# EAGLE design Mag_Read_STM_OUT (EAGLE 6.6.0)

## Sheet 1 of 3
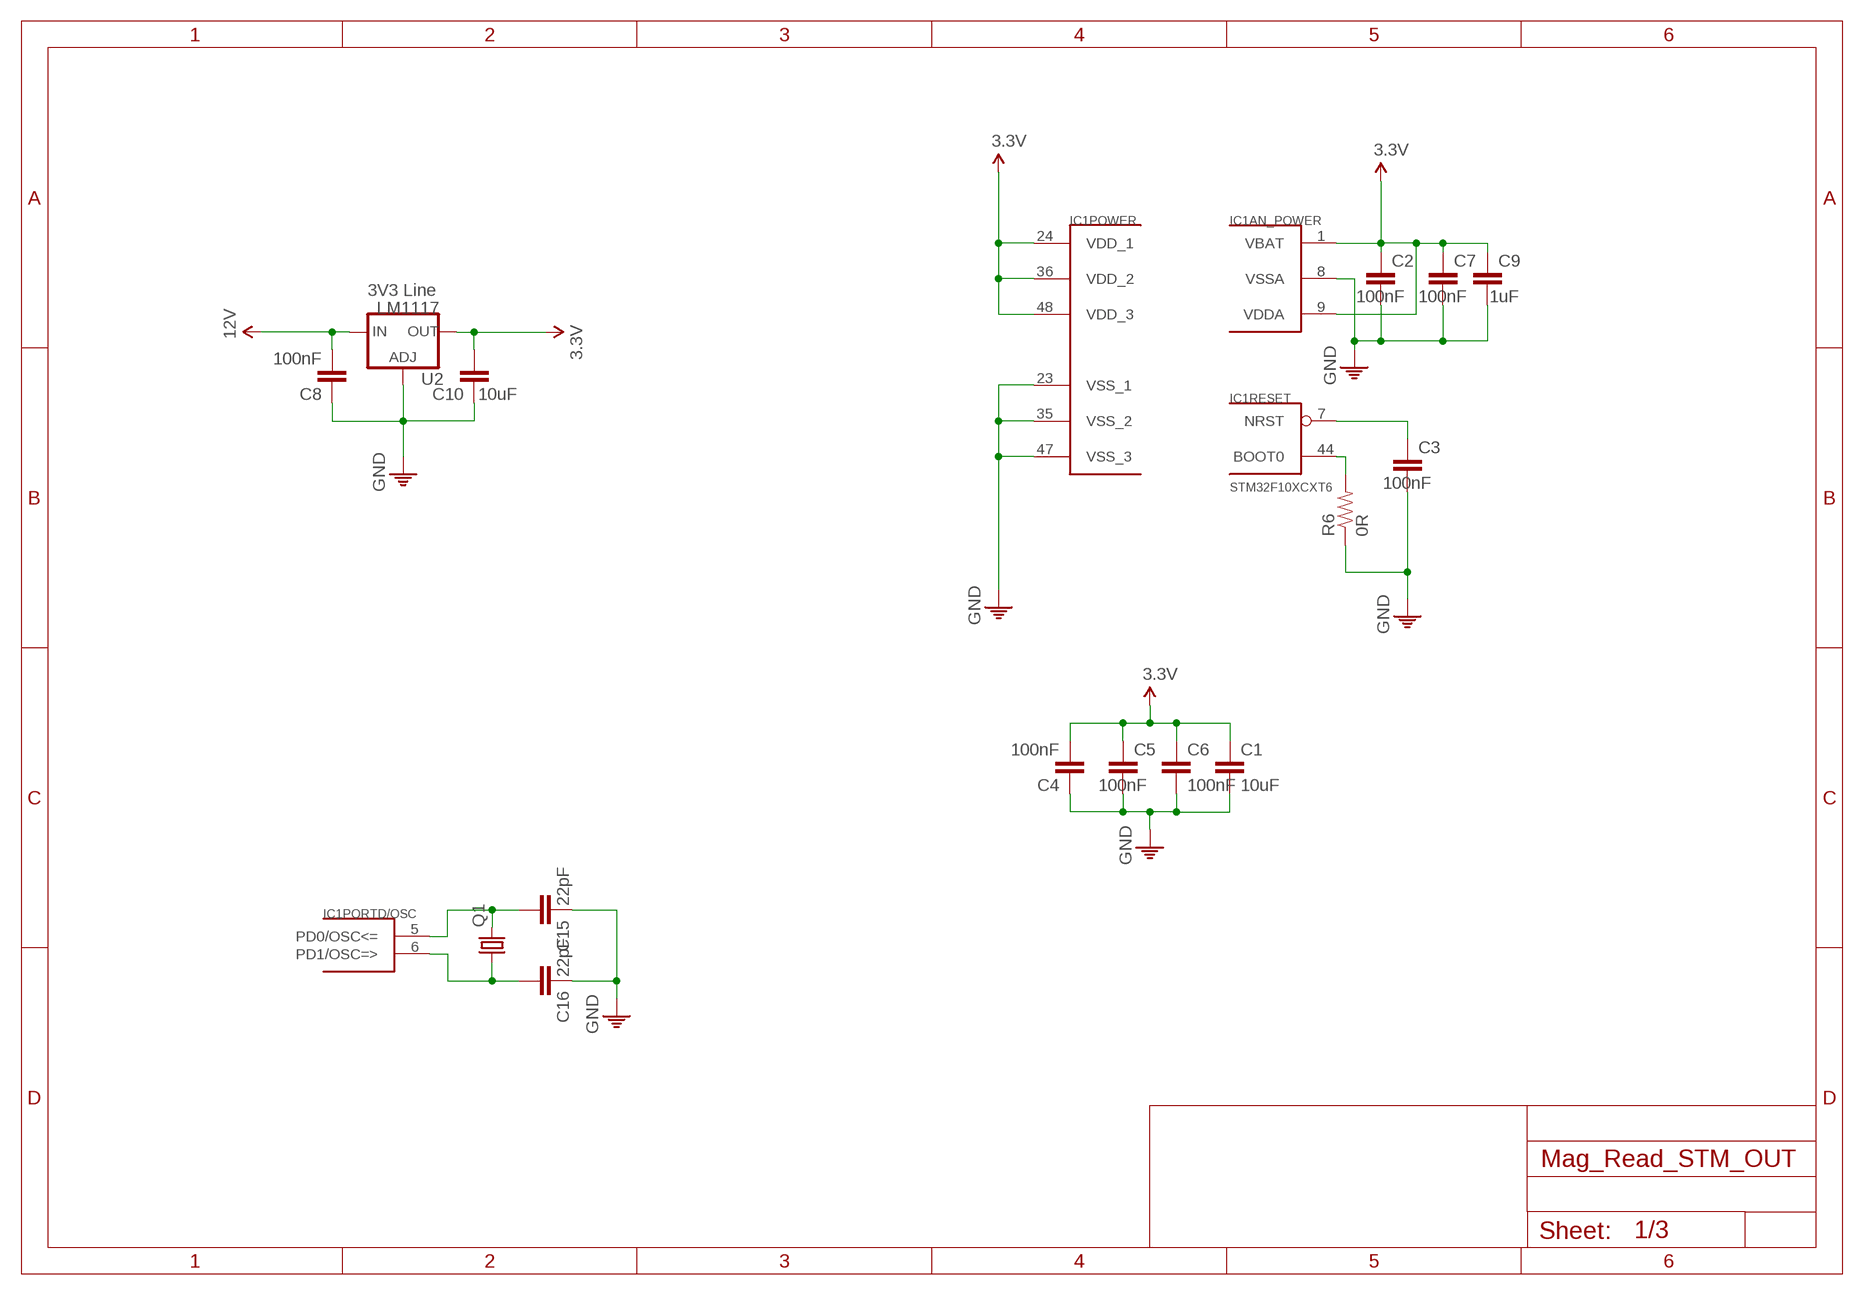
[diagram p0: schematic, sheet 1]

### Parts
C1  10uF  C-EUC0603  [C0603]
C2  100nF  C-EUC0603  [C0603]
C3  100nF  C-EUC0603  [C0603]
C4  100nF  C-EUC0603  [C0603]
C5  100nF  C-EUC0603  [C0603]
C6  100nF  C-EUC0603  [C0603]
C7  100nF  C-EUC0603  [C0603]
C8  100nF  C-EUC0603  [C0603]
C9  1uF  C-EUC0603  [C0603]
C10  10uF  C-EUC0603  [C0603]
C15  22pF  C-EUC0603  [C0603]
C16  22pF  C-EUC0603  [C0603]
IC1  STM32F10XCXT6  [TQFP48]
Q1  CRYSTALCTS406  [CTS406]
R6  0R  RESISTOR0603-RES  [0603-RES]
U2  LM1117  V_REG_317SMD  [SOT223]

### Nets
3.3V: C1.1 C2.1 C4.2 C5.1 C6.1 C7.1 C9.1 C10.2 IC1.1(AN_POWER:VBAT) IC1.9(AN_POWER:VDDA) IC1.24(POWER:VDD_1) IC1.36(POWER:VDD_2) IC1.48(POWER:VDD_3) U2.2(OUT) U2.4(OUT) ; also sheet 2,3
12V: C8.2 U2.3(IN) ; also sheet 3
GND: C1.2 C2.2 C3.2 C4.1 C5.2 C6.2 C7.2 C8.1 C9.2 C10.1 C15.1 C16.1 IC1.8(AN_POWER:VSSA) IC1.23(POWER:VSS_1) IC1.35(POWER:VSS_2) IC1.47(POWER:VSS_3) R6.1 U2.1(ADJ) ; also sheet 2,3
N$1: C15.2 IC1.5(PORTD/OSC:PD0/OSC<=) Q1.3
N$4: C16.2 IC1.6(PORTD/OSC:PD1/OSC=>) Q1.1
N$13: IC1.44(RESET:BOOT0) R6.2
NRST: C3.1 IC1.7(RESET:NRST) ; also sheet 3

### Notes on the sheet
- 3V3 Line

## Sheet 2 of 3
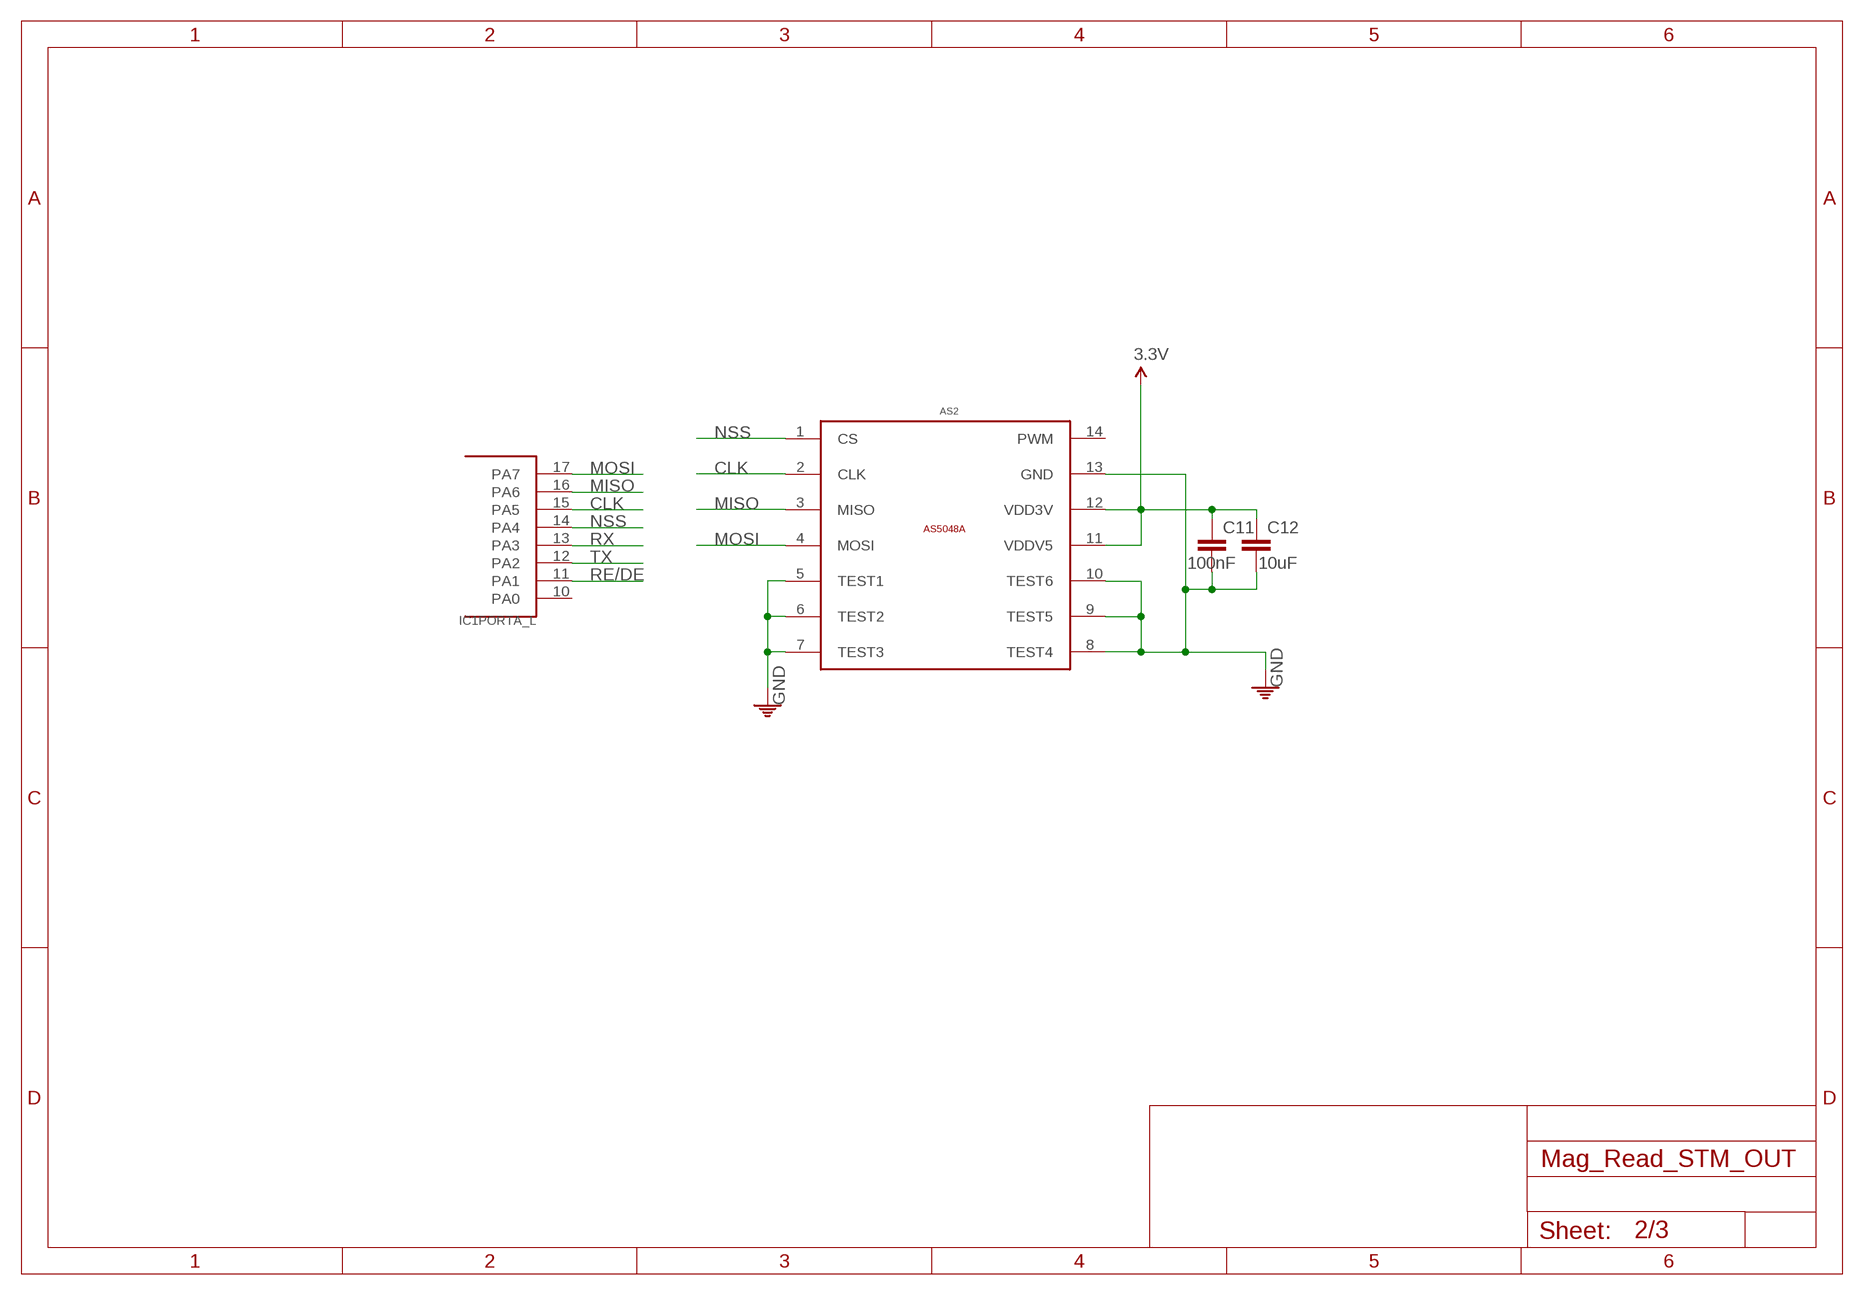
[diagram p1: schematic, sheet 2]

### Parts
AS2  AS5048A_MAGNETIC_ROTARY_ENCODERTSSOP14  [AS5048A_14-TSSOP]
C11  100nF  C-EUC0603  [C0603]
C12  10uF  C-EUC0603  [C0603]

### Nets
3.3V: AS2.11(VDDV5) AS2.12(VDD3V) C11.1 C12.1 ; also sheet 1,3
CLK: AS2.2(CLK) IC1.15(PORTA_L:PA5)
GND: AS2.5(TEST1) AS2.6(TEST2) AS2.7(TEST3) AS2.8(TEST4) AS2.9(TEST5) AS2.10(TEST6) AS2.13(GND) C11.2 C12.2 ; also sheet 1,3
MISO: AS2.3(MISO) IC1.16(PORTA_L:PA6)
MOSI: AS2.4(MOSI) IC1.17(PORTA_L:PA7)
NSS: AS2.1(CS) IC1.14(PORTA_L:PA4)
RE/DE: IC1.11(PORTA_L:PA1) ; also sheet 3
RX: IC1.13(PORTA_L:PA3) ; also sheet 3
TX: IC1.12(PORTA_L:PA2) ; also sheet 3
Unconnected: AS2.14(PWM) IC1.10(PORTA_L:PA0)

### Notes on the sheet
- NSS
- MOSI | CLK
- MISO
- CLK | MISO
- NSS
- RX | MOSI
- TX
- RE/DE

## Sheet 3 of 3
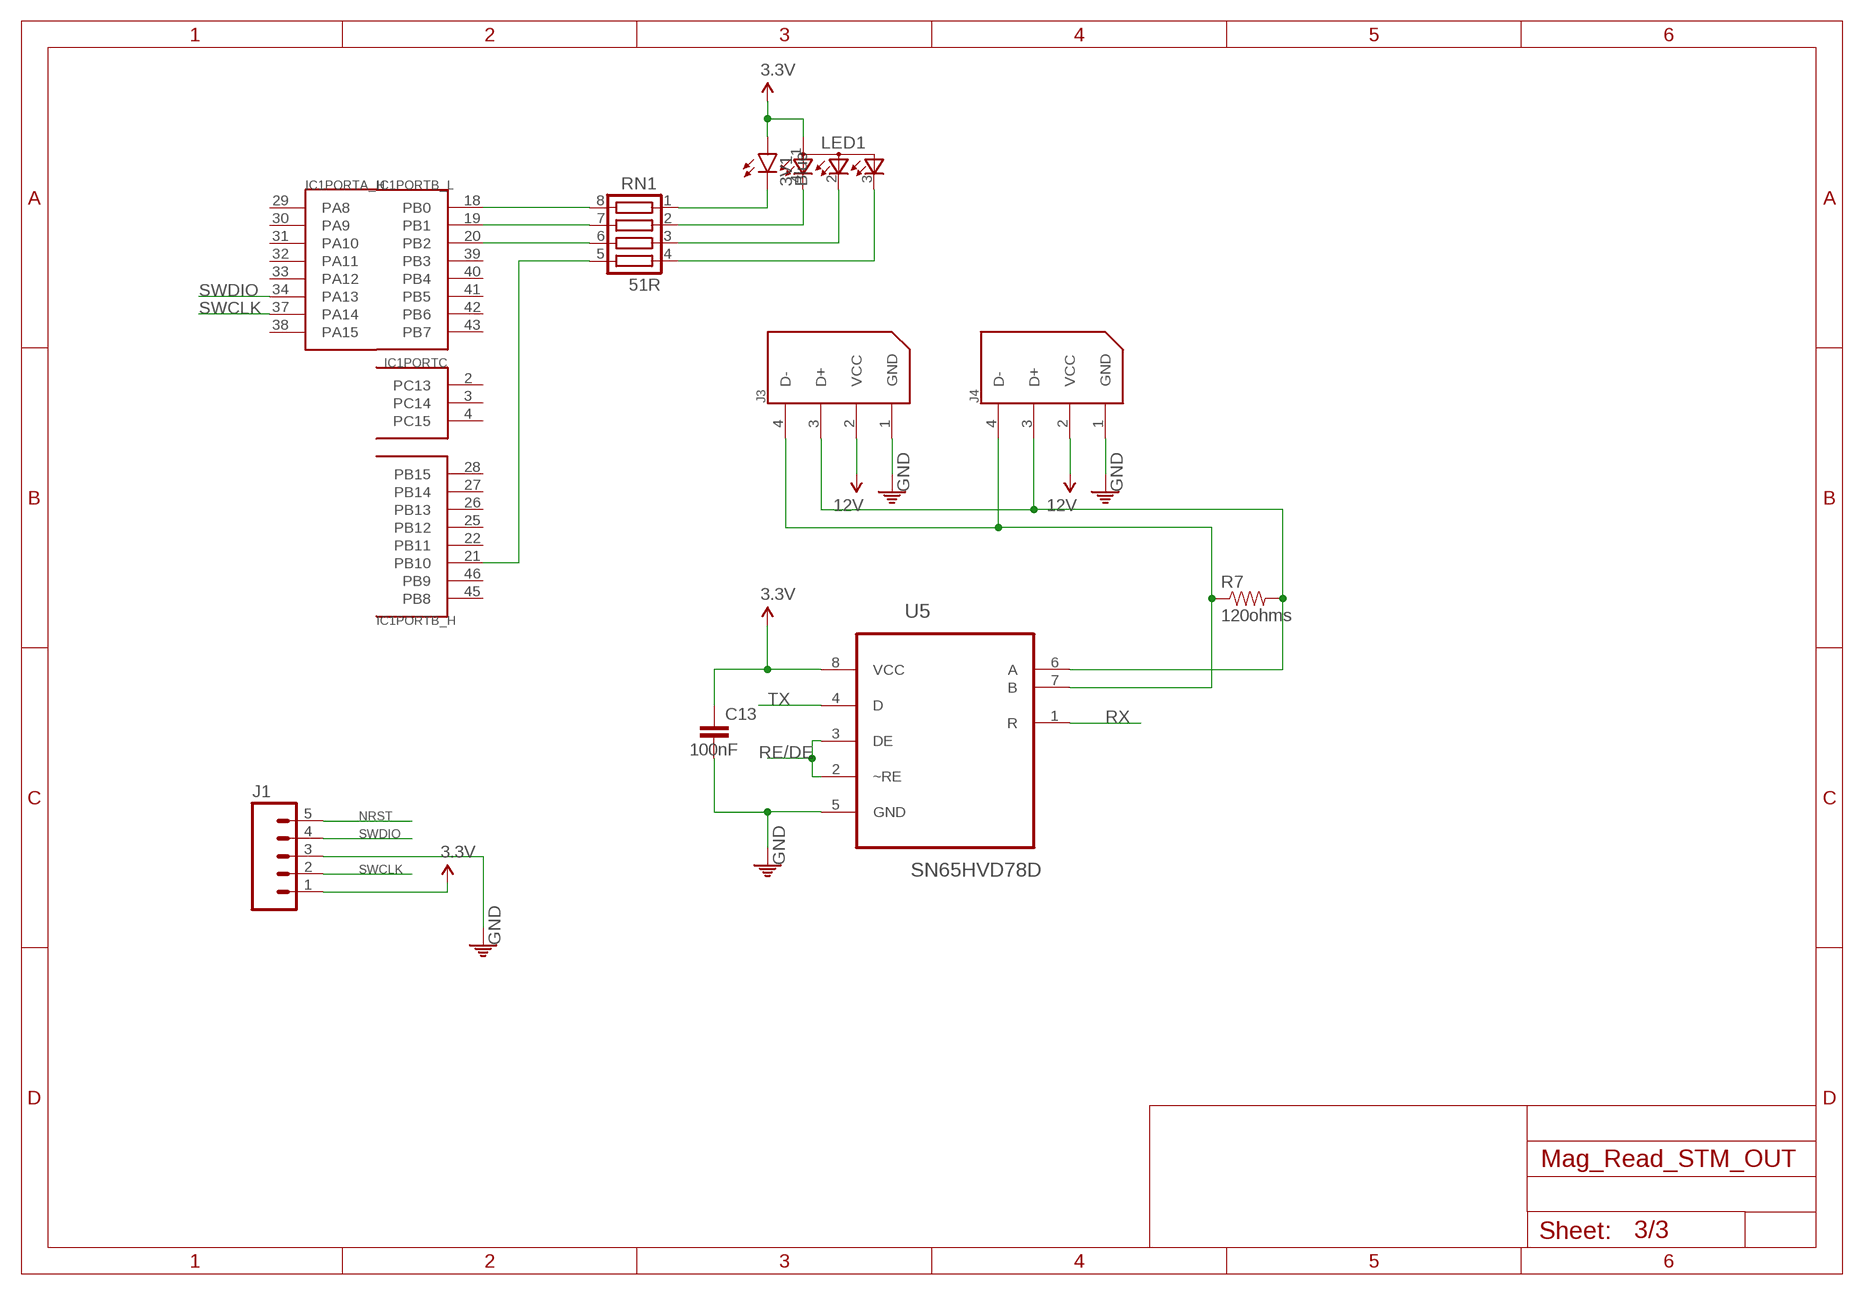
[diagram p2: schematic, sheet 3]

### Parts
3V1  Blue  LED0603  [LED-0603]
C13  100nF  C-EUC0603  [C0603]
J1  M05PTH  [1X05]
J3  22-03-5045  [5267-4]
J4  22-03-5045  [5267-4]
LED1  TOPLED-3  [P-LCC-4-3]
R7  120ohms  RESISTOR0603-RES  [0603-RES]
RN1  51R  CAY10-XXXJ  [CAY10-XXXJ4]
U5  SN65HVD78D  SN75176BD  [SOIC127P600X175-8N]

### Nets
3.3V: 3V1.A C13.1 J1.1 LED1.1(A2) U5.8(VCC) ; also sheet 1,2
12V: J3.2(VCC) J4.2(VCC) ; also sheet 1
D_N [diff.pairs]: J3.4(D-) J4.4(D-) R7.1 U5.7(B)
D_P [diff.pairs]: J3.3(D+) J4.3(D+) R7.2 U5.6(A)
GND: C13.2 J1.3 J3.1(GND) J4.1(GND) U5.5(GND) ; also sheet 1,2
N$2: LED1.4(CRED) RN1.2
N$3: LED1.2(CBLUE) RN1.3
N$5: LED1.3(CGREEN) RN1.4
N$6: 3V1.C RN1.1
N$7: IC1.21(PORTB_H:PB10) RN1.5
N$8: IC1.20(PORTB_L:PB2) RN1.6
N$9: IC1.19(PORTB_L:PB1) RN1.7
N$10: IC1.18(PORTB_L:PB0) RN1.8
NRST: J1.5 ; also sheet 1
RE/DE: U5.2(~RE) U5.3(DE) ; also sheet 2
RX: U5.1(R) ; also sheet 2
SWCLK: IC1.37(PORTA_H:PA14) J1.2
SWDIO: IC1.34(PORTA_H:PA13) J1.4
TX: U5.4(D) ; also sheet 2
Unconnected: IC1.2(PORTC:PC13) IC1.3(PORTC:PC14) IC1.4(PORTC:PC15) IC1.22(PORTB_H:PB11) IC1.25(PORTB_H:PB12) IC1.26(PORTB_H:PB13) IC1.27(PORTB_H:PB14) IC1.28(PORTB_H:PB15) IC1.29(PORTA_H:PA8) IC1.30(PORTA_H:PA9) IC1.31(PORTA_H:PA10) IC1.32(PORTA_H:PA11) IC1.33(PORTA_H:PA12) IC1.38(PORTA_H:PA15) IC1.39(PORTB_L:PB3) IC1.40(PORTB_L:PB4) IC1.41(PORTB_L:PB5) IC1.42(PORTB_L:PB6) IC1.43(PORTB_L:PB7) IC1.45(PORTB_H:PB8) IC1.46(PORTB_H:PB9)

### Notes on the sheet
- SWDIO
- SWCLK
- TX
- RX
- RE/DE
- NRST
- SWDIO
- SWCLK

## Library data of the parts
3V1 = SparkFun-LED:LED: LEDs Standard schematic elements and footprints for 5mm, 3mm, 1206, and 0603 sized LEDs. 5mm - Spark Fun Electronics SKU : COM-00529 (and others)
AS2 = xl_custom_lib:AS5048A_MAGNETIC_ROTARY_ENCODER: Austria Micro Systems Magnetic Rotary Encoder (14-bit Abgular Position Sensor) MFG PART #: AS5048A / AS5048A-HTSP-500 Interface: (SPI) Package: 14-TSSOP
C1-C13 C15 C16 = rcl:C-EU: CAPACITOR, European symbol
IC1 = stm32:STM32F10XCXT6: ST STM32F101/103 48pin LQFP
J1 = SparkFun-Connectors:M05: Header 5 Standard 5-pin 0.1" header. Use with straight break away headers (SKU : PRT-00116), right angle break away headers (PRT-00553), swiss pins (PRT-00743), machine pins (PRT-00117), and female headers (PRT-00115). Molex polarized connector foot print use with SKU : PRT-08230 with associated crimp pins and housings.
J3 J4 = molex-1:22-03-5045: Molex SPOX Vert, Tin (Dynamixel RX Bus) tested: YES (arbotix2)
LED1 = led:TOPLED-3: OSRAM - Hyper Multi TOPLED® (RGB) LB E673, LV E673, LT E673 - Power TOPLED® Enhanced optical Power LED (HOP2000) LS E67B, LA E67B, LO E67B, LY E67B - Hyper Multi TOPLED® Enhanced optical Power LED (HOP2000 / ATON®) LATB T66B - Hyper Multi TOPLED® Hyper-Bright LED LATB T686 Source: http://www.osram.convergy.de/
Q1 = crystal:CRYSTAL: CRYSTAL; OC_FARNELL: unknown; OC_NEWARK: unknown
R6 R7 = SparkFun-Passives:RESISTOR: Resistor Basic schematic elements and footprints for 0603, 1206, and PTH resistors.
RN1 = Robocup:CAY10-XXXJ
U2 = SparkFun-PowerIC:V_REG_317: Voltage Regulator Standard LM317 adjustable voltage regulator. AOI (Adjust Output Input). Google 'LM317 Calculator' for easy to use app to get the two resistor values needed. 240/720 for 5V output. 240/390 for 3.3V output. Spark Fun Electronics SKU : COM-00527
U5 = Robocup:SN75176BD: DIFFERENTIAL BUS TRANSCEIVER; MPN: SN75176BD; OC_FARNELL: 1103176; OC_NEWARK: 08F8127; PACKAGE: SOIC-8; SUPPLIER: Texas Instruments

## Net classes
0 default: clearance 0.205 mm
1 diff.pairs: width 0.254 mm, clearance 0.205 mm to class 0, clearance 0.318 mm

## Board
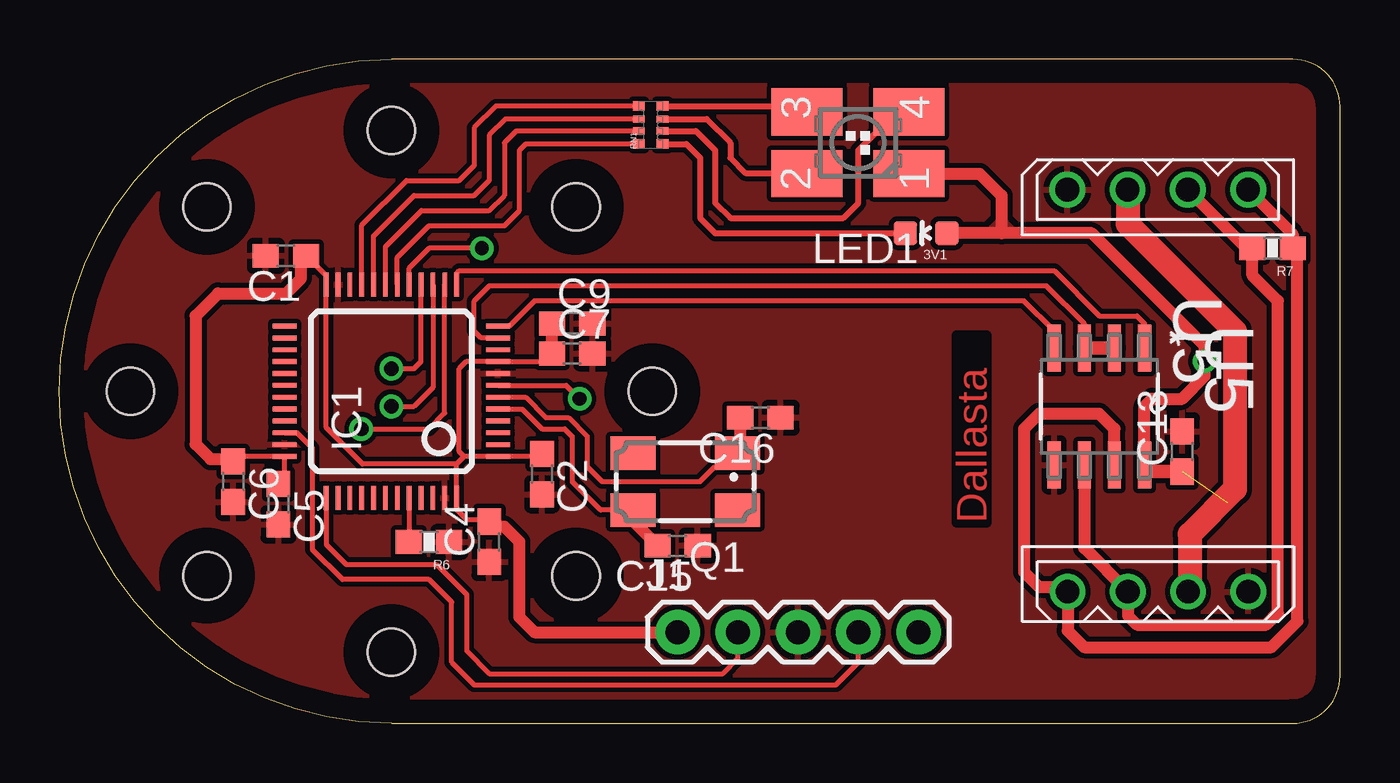
[diagram p3: board, top side]
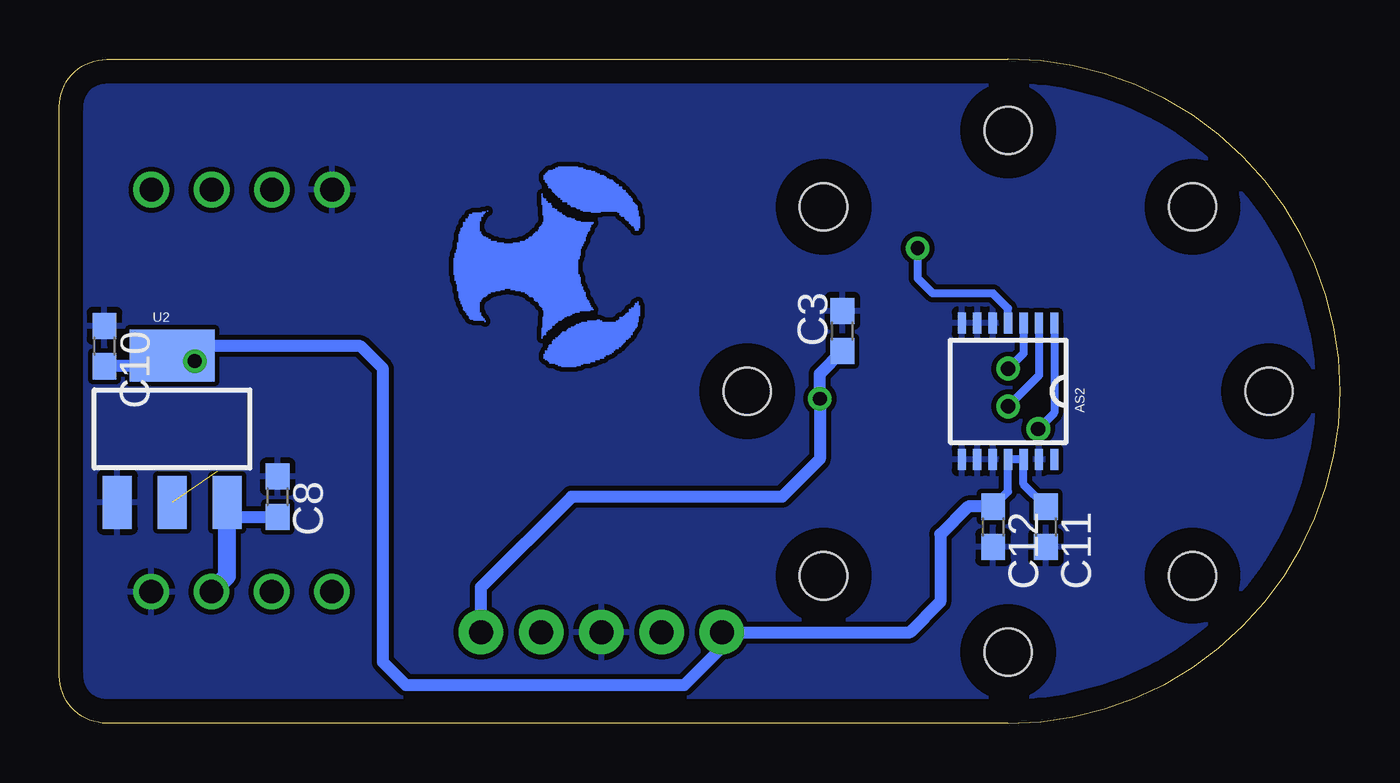
[diagram p4: board, bottom side, seen from below]

Size 54 x 28 mm. Coordinates in mm from the lower left corner, seen from the top.
Outline: 14,0 arc-180 14,28 52,28 arc-90 54,26 54,2 arc-90 52,0 14,0
Copper layers (1*16): Top 0.035mm / dielectric 1.5mm / Bottom 0.035mm
Design rules "default *": minimum track width 8mil, minimum drill 23mil, track to track 8mil, track to pad 8mil, pad to pad 8mil, via to via 8mil, smd to smd 8mil, copper to edge 40mil, drill to drill 8mil, minimum pad ring 10mil, minimum via ring 8mil, stop-mask expansion 4mil, vias tented up to drill 0mil, thermal gap 10mil
Holes 2 mm at 3,14 25,14 14,25 14,3 6.22,21.78 21.78,21.78 6.22,6.22 21.78,6.22
tRestrict: area -2.5,-3.1 to 56.5,30.8; area 10.2,28.6 to 12.7,30.8; area 53.4,27.7 to 54.6,28.9; area 53.7,-0.6 to 54.6,0.3; area 38.1,8.8 to 38.9,9.1; area 38,11.3 to 38.9,11.6

### Footprints (pad centres in the part's own frame; a part is rotated, then mirrored left to right if it is on the bottom)
LED-0603 = smd 1 x 1: A 0,-0.877; C 0,0.877
AS5048A_14-TSSOP = smd 0.9 x 0.35: 1 -2.875,1.95; 2 -2.875,1.3; 3 -2.875,0.65; 4 -2.875,0; 5 -2.875,-0.65; 6 -2.875,-1.3; 7 -2.875,-1.95; 8 2.875,-1.95; 9 2.875,-1.3; 10 2.875,-0.65; 11 2.875,0; 12 2.875,0.65; 13 2.875,1.3; 14 2.875,1.95
C0603 = smd 1.1 x 1: 1 -0.85,0; 2 0.85,0
TQFP48 = smd 0.2 x 1: 1 -2.75,-4.5; 2 -2.25,-4.5; 3 -1.75,-4.5; 4 -1.25,-4.5; 5 -0.75,-4.5; 6 -0.25,-4.5; 7 0.25,-4.5; 8 0.75,-4.5; 9 1.25,-4.5; 10 1.75,-4.5; 11 2.25,-4.5; 12 2.75,-4.5; 25 2.75,4.5; 26 2.25,4.5; 27 1.75,4.5; 28 1.25,4.5; 29 0.75,4.5; 30 0.25,4.5; 31 -0.25,4.5; 32 -0.75,4.5; 33 -1.25,4.5; 34 -1.75,4.5; 35 -2.25,4.5; 36 -2.75,4.5 | smd 1 x 0.2: 13 4.5,-2.75; 14 4.5,-2.25; 15 4.5,-1.75; 16 4.5,-1.25; 17 4.5,-0.75; 18 4.5,-0.25; 19 4.5,0.25; 20 4.5,0.75; 21 4.5,1.25; 22 4.5,1.75; 23 4.5,2.25; 24 4.5,2.75; 37 -4.5,2.75; 38 -4.5,2.25; 39 -4.5,1.75; 40 -4.5,1.25; 41 -4.5,0.75; 42 -4.5,0.25; 43 -4.5,-0.25; 44 -4.5,-0.75; 45 -4.5,-1.25; 46 -4.5,-1.75; 47 -4.5,-2.25; 48 -4.5,-2.75
1X05 = drill 1.016 pad 1.88: 1 0,0; 2 2.54,0; 3 5.08,0; 4 7.62,0; 5 10.16,0
5267-4 = drill 1: 1 0,0; 2 -2.54,0; 3 -5.08,0; 4 -7.62,0
P-LCC-4-3 = smd 2 x 3: 1 -1.3,-2.15; 2 -1.3,2.15; 3 1.3,2.15; 4 1.3,-2.15
CTS406 = smd 1.9 x 1.4: 1 -2.2,-1.2; 2 2.2,-1.2; 3 2.2,1.2; 4 -2.2,1.2
0603-RES = smd 1.1 x 1: 1 -0.85,0; 2 0.85,0
CAY10-XXXJ4 = smd 0.4 x 0.5: 1 -0.05,0; 4 1.55,0; 5 1.55,1; 8 -0.05,1 | smd 0.3 x 0.5: 2 0.5,0; 3 1,0; 6 1,1; 7 0.5,1
SOT223 = smd 1.219 x 2.235: 1 -2.311,-3.099; 2 0,-3.099; 3 2.311,-3.099 | smd 3.6 x 2.2: 4 0,3.099
SOIC127P600X175-8N = smd 1.981 x 0.559: 1 -2.464,1.905; 2 -2.464,0.635; 3 -2.464,-0.635; 4 -2.464,-1.905; 5 2.464,-1.905; 6 2.464,-0.635; 7 2.464,0.635; 8 2.464,1.905

### Placement (x,y rotation side)
3V1  36.54,20.67 90 top
AS2  14,14 270 bottom
C1  9.55,19.71 180 top
C2  20.35,10.51 270 top
C3  20.98,16.54 90 bottom
C4  18.13,7.65 90 top
C5  9.24,9.24 270 top
C6  7.33,10.19 270 top
C7  21.62,15.59 0 top
C8  44.8,9.55 270 bottom
C9  21.62,16.86 0 top
C10  52.1,15.9 270 bottom
C11  12.41,8.29 270 bottom
C12  14.63,8.29 270 bottom
C13  47.34,11.46 90 top
C15  26.06,7.49 180 top
C16  29.56,12.89 180 top
IC1  14,14 90 top
J1  26.06,3.84 0 top
J3  42.5,22.5 180 top
J4  50.13,5.55 0 top
LED1  33.67,24.48 90 top
Q1  26.38,10.19 180 top
R6  15.59,7.65 180 top
R7  51.15,20.03 180 top
RN1  25.43,24.48 90 top
U2  49.24,12.41 0 bottom
U5  43.84,13.37 270 top

### Tracks (layer width: path | path; a pad name or v marks a point on that pad's centre or on a via)
3.3V  (via drill 0.58)  (1 unrouted)
  Top 0.203: C7.1 20.75,15.25 IC1.9 17.16,15.25 16.86,14.95 16.86,11.46 17.07,11.25 | 17.07,11.25 IC1.1 20.24,11.25 C2.1 | 18.02,8.92 C4.2 18.02,8.6 17.18,8.6 16.75,9.03 IC1.48 16.75,10.93 | 16.75,10.93 17.07,11.25 | C1.1 11.25,18.87 IC1.24 11.25,12.46 12.78,10.93 16.75,10.93 | C6.1 arc-90 7.66,11.25 IC1.36 9.5,10.09 C5.1
  Top 0.508: C7.1 C9.1 | C13.1 45.97,10.61 45.75,10.82 45.75,13.37 46.07,13.68 47.34,13.68 48.29,14.63 v48.29,15.27 48.29,15.9 43.53,20.67 39.72,20.67 | 39.72,20.67 3V1.A | C4.2 18.34,8.29 18.76,8.29 19.4,7.65 19.4,4.47 20.03,3.84 J1.1 | C6.1 7.23,11.14 6.38,11.14 5.74,11.78 5.74,17.18 6.7,18.13 9.55,18.13 10.19,18.76 10.19,19.5 C1.1 | LED1.1 38.8,23.18 39.72,22.26 39.72,20.67
  Top 0.559: U5.8 45.75,10.82 45.75,10.61 C13.1
  Bottom 0.343: C11.1 13.35,10.07 AS2.12 AS2.11 14,9.77 C12.1
  Bottom 0.508: C10.2 49.24,15.05 U2.4 48.85,15.9 | 48.85,15.9 41.3,15.9 40.35,14.95 40.35,2.57 39.4,1.62 27.65,1.62 26.06,3.21 J1.1 18.13,3.84 16.86,5.11 16.86,7.97 15.69,9.13 C12.1 | 48.85,15.9 48.85,15.83 v48.29,15.27
  pour Top: 39.72,21.3 39.08,20.67 40.35,20.67
12V
  Top 1.016: J3.2 45.04,21.06 49.56,16.54 49.56,9.87 47.66,7.97 47.66,5.62 J4.2
  Bottom 0.508: U2.3 46.93,8.71 C8.2
  Bottom 0.762: J4.2 46.93,6.21 U2.3
CLK  (via drill 0.6)
  Top 0.203: v14,13.37 14.95,13.37 15.75,14.16 IC1.15
  Bottom 0.343: AS2.2 12.7,14.66 v14,13.37
D_N
  Top 0.508: J3.4 52,20.62 R7.1 52.2,19.84 52.2,4.3 51.1,3.21 43.21,3.21 42.51,3.9 J4.4 42.31,5.74 41.3,5.74 40.67,6.38 40.67,12.41 41.3,13.05 43.84,13.05 44.48,12.41 U5.7
D_P
  Top 0.508: 50.35,19.98 R7.2 | R7.2 50.05,20.03 J3.3 | U5.6 43.21,7.39 J4.3 45.05,4.54 45.43,4.16 50.88,4.16 51.37,4.65 51.37,17.81 50.3,18.88 R7.2
GND
  pour Bottom: -2.19,30.51 56.23,30.51 56.23,-2.83 -2.19,-2.83
  pour Top (isolate 0.013, rank 6): -2.19,30.51 56.23,30.51 56.23,-0.29 56.23,-2.83 -2.19,-2.83
MISO  (via drill 0.6)
  Top 0.203: v14,14.95 14.95,14.95 15.25,15.25 IC1.16
  Bottom 0.343: AS2.3 13.35,15.6 v14,14.95
MOSI  (via drill 0.58)
  Top 0.203: v17.81,20.03 15.59,20.03 14.75,19.2 IC1.17
  Bottom 0.343: AS2.4 14,17.49 14.63,18.13 17.18,18.13 17.81,18.76 v17.81,20.03
N$1
  Top 0.203: Q1.3 22.82,8.99 21.62,10.19 21.62,12.1 21.3,12.41 20.35,12.41 19.51,13.25 IC1.5
  Top 0.508: C15.2 24.18,8.52 Q1.3
N$2
  Top 0.254: RN1.2 26.84,24.98 27.65,24.16 27.65,21.94 28.29,21.3 33.05,21.3 33.69,21.94 33.69,24.16 34.95,25.43 35.48,25.43 LED1.4
N$3
  Top 0.254: RN1.3 27.29,25.48 28.29,24.48 28.29,23.84 28.92,23.21 31.49,23.21 LED1.2
N$4
  Top 0.203: Q1.1 28.34,10.82 27.65,10.82 27.02,10.19 22.89,10.19 22.26,10.82 22.26,12.1 21.46,12.89 20.51,12.89 19.65,13.75 IC1.6
  Top 0.508: Q1.1 28.71,11.2 C16.2
N$5
  Top 0.254: RN1.4 31.27,26.03 LED1.3
N$6
  Top 0.254: RN1.1 26.43,24.43 27.02,23.84 27.02,21.3 27.65,20.67 3V1.C
N$7
  Top 0.203: IC1.21 12.75,21 14.63,22.89 16.86,22.89 17.49,23.52 17.49,25.11 18.41,26.03 RN1.5
N$8
  Top 0.203: IC1.20 13.25,20.55 14.95,22.26 17.49,22.26 18.13,22.89 18.13,24.8 18.81,25.48 RN1.6
N$9
  Top 0.203: IC1.19 13.75,20.1 15.27,21.62 18.13,21.62 18.76,22.26 18.76,24.48 19.26,24.98 RN1.7
N$10
  Top 0.203: IC1.18 14.25,19.65 15.59,20.98 18.76,20.98 19.4,21.62 19.4,24.16 19.66,24.43 RN1.8
N$13
  Top 0.203: IC1.44 14.75,7.66 R6.2
NRST  (via drill 0.58)
  Top 0.203: IC1.7 21.37,14.25 v21.94,13.68
  Bottom 0.508: C3.1 21.94,14.74 v21.94,13.68 21.94,11.14 23.52,9.55 32.41,9.55 36.23,5.74 J1.5
NSS  (via drill 0.6)
  Top 0.203: v12.73,12.41 15.59,12.41 16.25,13.07 IC1.14
  Bottom 0.343: AS2.1 12.05,13.09 v12.73,12.41
RE/DE
  Top 0.203: IC1.11 17.78,16.25 17.49,16.54 17.49,17.81 18.13,18.45 41.62,18.45 43.21,16.86 U5.3
  Top 0.559: U5.3 U5.2
RX
  Top 0.203: IC1.13 16.75,18.97 16.86,19.08 41.94,19.08 43.84,17.18 45.43,17.18 45.75,16.86 U5.1
SWCLK
  Top 0.203: IC1.37 11.25,7.54 12.1,6.7 15.9,6.7 17.18,5.43 17.18,3.05 18.13,2.09 27.97,2.09 28.61,2.73 J1.2
SWDIO
  Top 0.203: IC1.34 10.04,12.25 10.67,11.62 10.67,7.33 11.94,6.06 15.59,6.06 16.54,5.11 16.54,2.57 17.49,1.62 32.73,1.62 33.69,2.57 J1.4
TX
  Top 0.203: U5.4 41.94,16.54 40.67,17.81 20.03,17.81 18.97,16.75 IC1.12
(copper drawn outside any net)
  shapes: Bottom area x308

### Text on the board
Top: Dallasta